# Altium project 安卓果园检测.PrjPcb
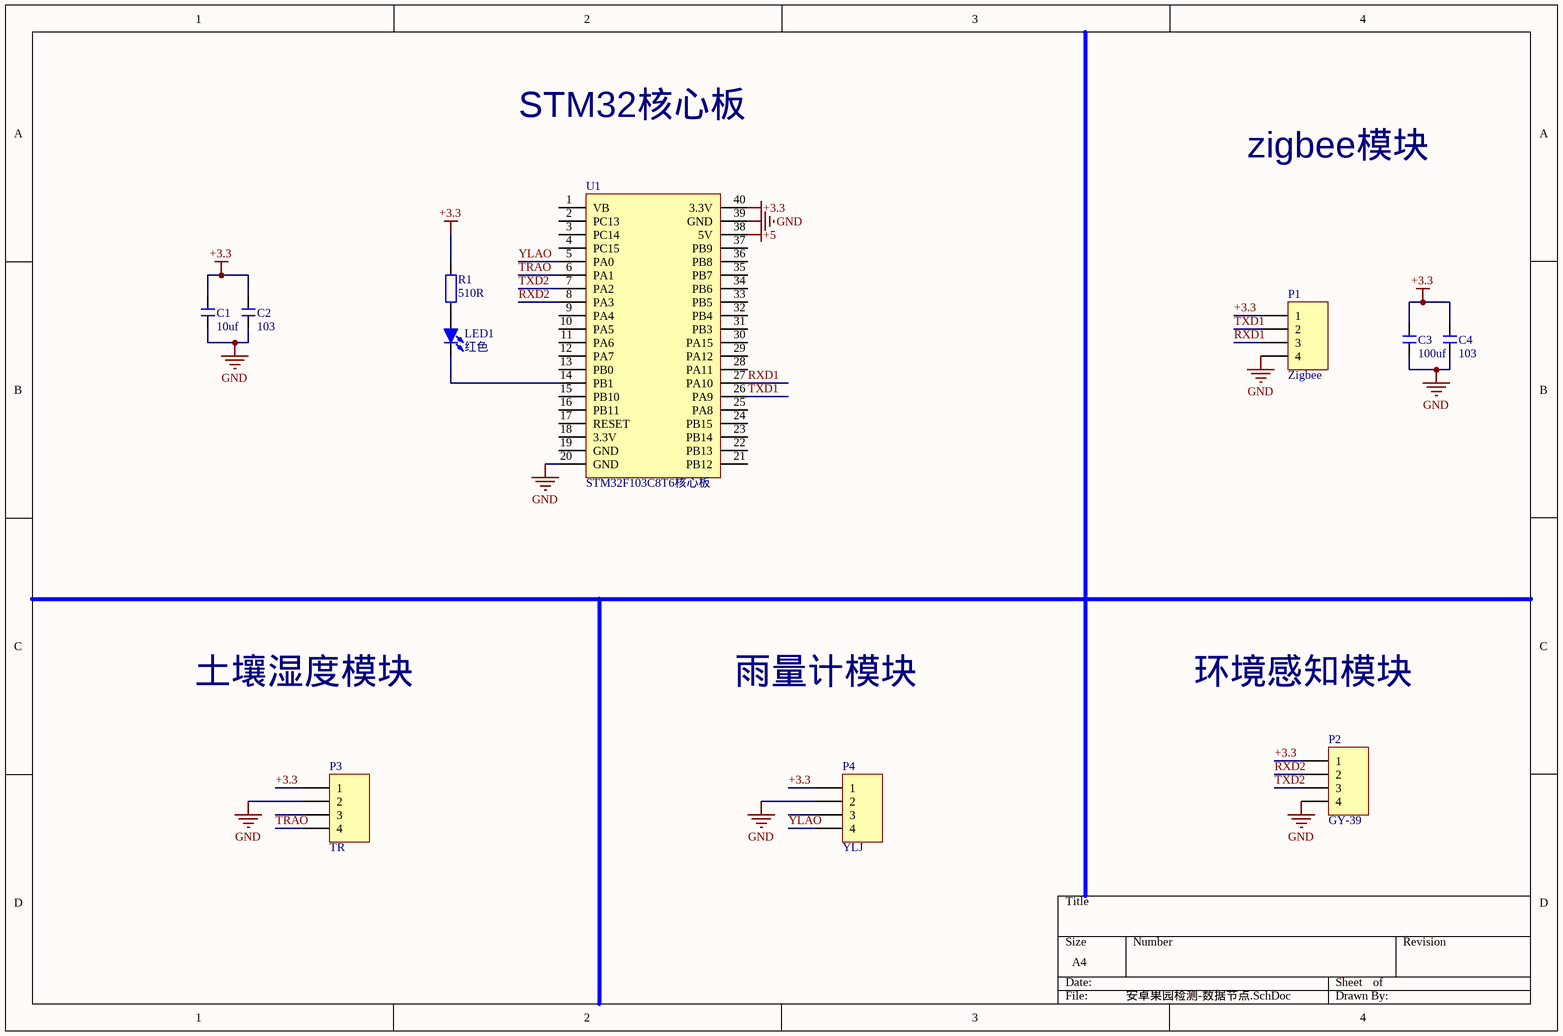
[diagram p0: 安卓果园检测-数据节点.SchDoc]
2 sheets, 31 parts. Net scope: global (net labels, ports and power ports of the same name join across sheets).
Sheets:
  安卓果园检测-数据节点.SchDoc
  安卓果园检测-转发节点.SchDoc

## Sheet 安卓果园检测-数据节点.SchDoc
size A4

### Parts
C1  10uf  [R 0805_M]
C2  103  [R 0805_M]
C3  100uf  [R 0805_M]
C4  103  [R 0805_M]
LED1  红色  [LED 0805R]
P1  Zigbee  [HDR1X4]
P2  GY-39  [HDR1X4]
P3  TR  [HDR1X4]
P4  YLJ  [HDR1X4]
R1  510R  [R 0805_M]
U1  STM32F103C8T6核心板  [DIP40-600_MH]

### Nets
+3.3: C1.1 C2.1 C3.1 C4.1 P1.1 P2.1 P3.1 P4.1 R1.2 U1.40(3.3V)
+5: U1.38(5V)
GND: C1.2 C2.2 C3.2 C4.2 P1.4 P2.4 P3.2 P4.2 U1.20(GND) U1.39(GND)
RXD1: P1.3 U1.27(PA10)
RXD2: P2.2 U1.8(PA3)
TRAO: P3.4 U1.6(PA1)
TXD1: P1.2 U1.26(PA9)
TXD2: P2.3 U1.7(PA2)
YLAO: P4.4 U1.5(PA0)
NetLED1_1: LED1.1(A) R1.1
NetLED1_2: LED1.2(K) U1.14(PB1)

Not connected (* = marked no-connect by the designer): P3 3; P4 3; U1 1(VB) 2(PC13) 3(PC14) 4(PC15) 9(PA4) 10(PA5) 11(PA6) 12(PA7) 13(PB0) 15(PB10) 16(PB11) 17(RESET) 18(3.3V) 19(GND) 21(PB12) 22(PB13) 23(PB14) 24(PB15) 25(PA8) 28(PA11) 29(PA12) 30(PA15) 31(PB3) 32(PB4) 33(PB5) 34(PB6) 35(PB7) 36(PB8) 37(PB9)

### Notes on the sheet
- STM32核心板
- zigbee模块
- 土壤湿度模块
- 雨量计模块
- 环境感知模块

### Library data of the parts
C1-C4 = C-CC: 直插瓷片电容; 版权归属: 源创客; BOM名称: 直插瓷片电容; 学习资源: www.ooocke.com
LED1 = LED-SMD: 贴片LED; 版权归属: 源创客; BOM名称: 贴片LED; 学习资源: www.ooocke.com
P1-P4 = Header 4: Header, 4-Pin; LatestRevisionDate: 17-Jul-2002; LatestRevisionNote: Re-released for DXP Platform.; Publisher: Altium Limited
R1 = R-CRR: 直插色环电阻; BOM名称: 色环电阻; 版权归属: 源创客; 学习资源: www.ooocke.com

## Sheet 安卓果园检测-转发节点.SchDoc
size A4
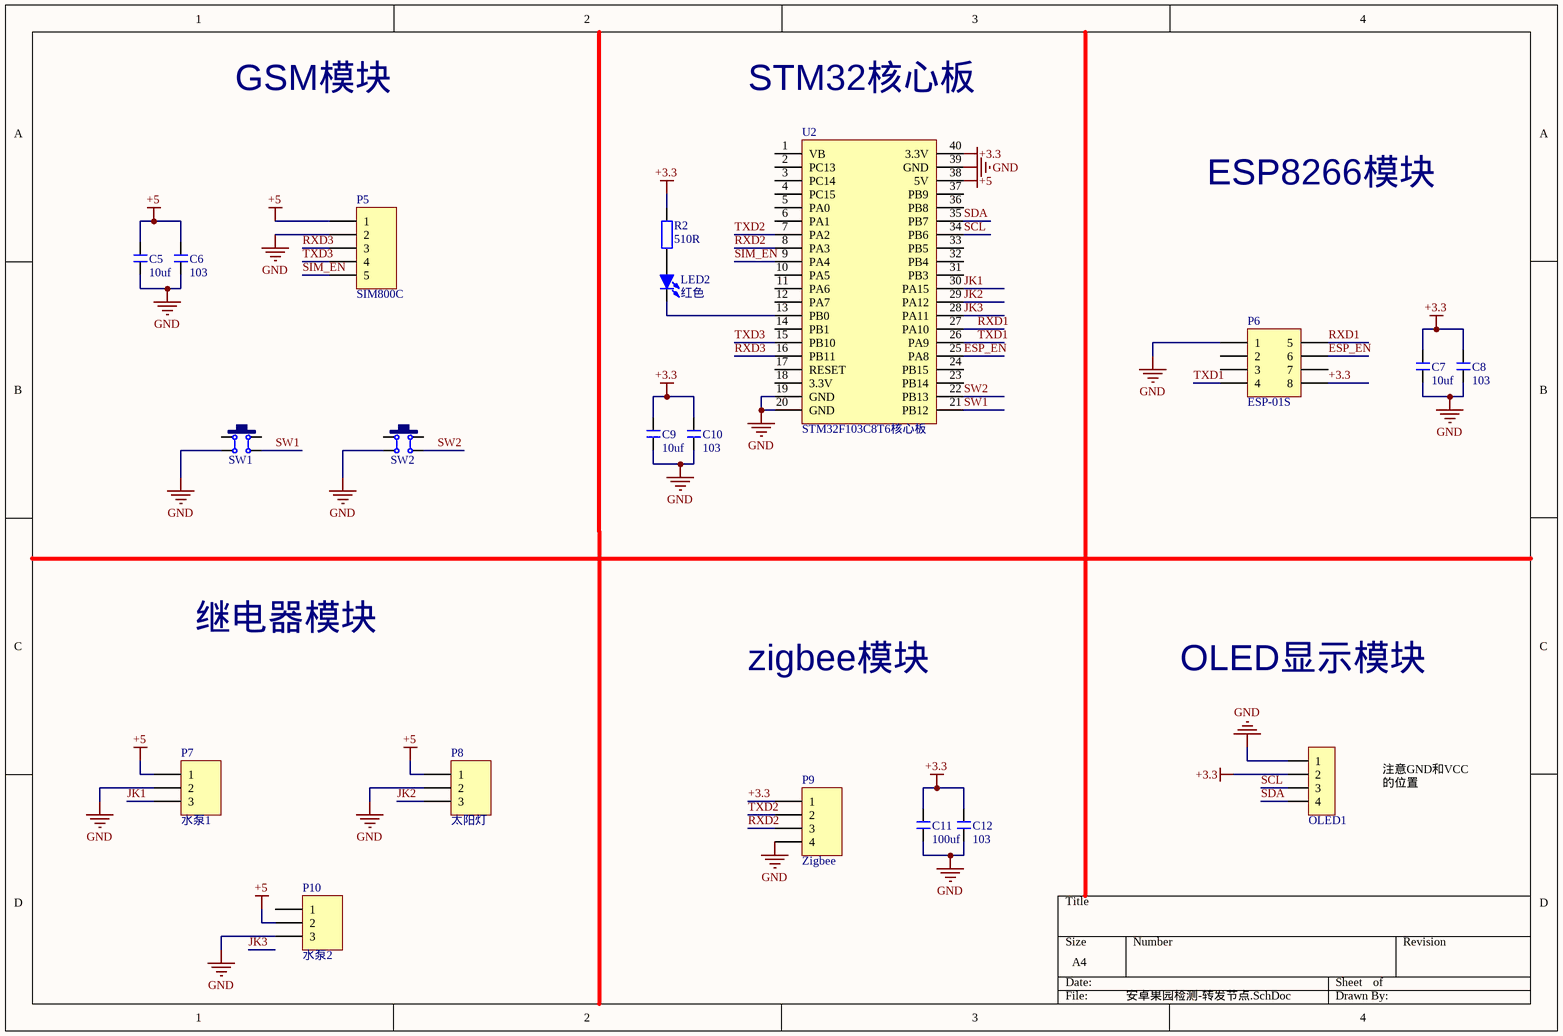
[diagram p1: 安卓果园检测-转发节点.SchDoc]

### Parts
C5  10uf  [R 0805_M]
C6  103  [R 0805_M]
C7  10uf  [R 0805_M]
C8  103  [R 0805_M]
C9  10uf  [R 0805_M]
C10  103  [R 0805_M]
C11  100uf  [R 0805_M]
C12  103  [R 0805_M]
LED2  红色  [LED 0805R]
OLED1  HDR-1X4  [HDR2.54-M-LI-4P]  (value not drawn)
P5  SIM800C  [HDR1X5]
P6  ESP-01S  [HDR2X4_CEN]
P7  水泵1  [MHDR1X3]
P8  太阳灯  [MHDR1X3]
P9  Zigbee  [HDR1X4]
P10  水泵2  [MHDR1X3]
R2  510R  [R 0805_M]
SW1  6x6x5  [TSW SMD-6*6*4.3]  (value not drawn)
SW2  6x6x5  [TSW SMD-6*6*4.3]  (value not drawn)
U2  STM32F103C8T6核心板  [DIP40-600_MH]

### Nets
+3.3: C7.1 C8.1 C9.1 C10.1 C11.1 C12.1 OLED1.2 P6.8 P9.1 R2.2 U2.40(3.3V)
+5: C5.1 C6.1 P5.1 P7.1 P8.1 P10.2 U2.38(5V)
GND: C5.2 C6.2 C7.2 C8.2 C9.2 C10.2 C11.2 C12.2 OLED1.1 P5.2 P6.1 P7.2 P8.2 P9.4 P10.3 SW1.4 SW2.4 U2.19(GND) U2.20(GND) U2.39(GND)
ESP_EN: P6.6 U2.25(PA8)
JK1: P7.3 U2.30(PA15)
JK2: P8.3 U2.29(PA12)
JK3: U2.28(PA11)
RXD1: P6.5 U2.27(PA10)
RXD2: P9.3 U2.8(PA3)
RXD3: P5.3 U2.16(PB11)
SCL: OLED1.3 U2.34(PB6)
SDA: OLED1.4 U2.35(PB7)
SIM_EN: P5.5 U2.9(PA4)
SW1: SW1.3 U2.21(PB12)
SW2: SW2.3 U2.22(PB13)
TXD1: P6.4 U2.26(PA9)
TXD2: P9.2 U2.7(PA2)
TXD3: P5.4 U2.15(PB10)
NetLED2_1: LED2.1(A) R2.1
NetLED2_2: LED2.2(K) U2.13(PB0)

Not connected (* = marked no-connect by the designer): P6 2 3 7; P10 1; SW1 1 2; SW2 1 2; U2 1(VB) 2(PC13) 3(PC14) 4(PC15) 5(PA0) 6(PA1) 10(PA5) 11(PA6) 12(PA7) 14(PB1) 17(RESET) 18(3.3V) 23(PB14) 24(PB15) 31(PB3) 32(PB4) 33(PB5) 36(PB8) 37(PB9)

### Notes on the sheet
- GSM模块
- STM32核心板
- ESP8266模块
- 继电器模块
- zigbee模块
- OLED显示模块
- 注意GND和VCC的位置

### Library data of the parts
C5-C12 = C-CC: 直插瓷片电容; 版权归属: 源创客; BOM名称: 直插瓷片电容; 学习资源: www.ooocke.com
LED2 = LED-SMD: 贴片LED; 版权归属: 源创客; BOM名称: 贴片LED; 学习资源: www.ooocke.com
OLED1 = Header 4: 4P接插件; 版权归属: 源创客; BOM名称: 4P接插件; 学习资源: www.ooocke.com
P5 = Header 5: Header, 5-Pin; LatestRevisionDate: 17-Jul-2002; LatestRevisionNote: Re-released for DXP Platform.; Publisher: Altium Limited
P6 = Header 4X2A: Header, 4-Pin, Dual row; LatestRevisionDate: 17-Jul-2002; LatestRevisionNote: Re-released for DXP Platform.; Publisher: Altium Limited
P7 P8 P10 = MHDR1X3: Header, 3-Pin; LatestRevisionDate: 17-Jul-2002; LatestRevisionNote: Re-released for DXP Platform.; Publisher: Altium Limited
P9 = Header 4: Header, 4-Pin; LatestRevisionDate: 17-Jul-2002; LatestRevisionNote: Re-released for DXP Platform.; Publisher: Altium Limited
R2 = R-CRR: 直插色环电阻; BOM名称: 色环电阻; 版权归属: 源创客; 学习资源: www.ooocke.com
SW1 SW2 = TSW SMD-6x6: 贴片6x6轻触开关; 版权归属: 源创客; BOM名称: 贴片6x6轻触开关; 学习资源: www.ooocke.com

## Nets that join several sheets
+3.3: 安卓果园检测-数据节点 (10 pins), 安卓果园检测-转发节点 (11 pins)
+5: 安卓果园检测-数据节点 (U1.38), 安卓果园检测-转发节点 (7 pins)
GND: 安卓果园检测-数据节点 (10 pins), 安卓果园检测-转发节点 (20 pins)
RXD1: 安卓果园检测-数据节点 (P1.3 U1.27), 安卓果园检测-转发节点 (P6.5 U2.27)
RXD2: 安卓果园检测-数据节点 (P2.2 U1.8), 安卓果园检测-转发节点 (P9.3 U2.8)
TXD1: 安卓果园检测-数据节点 (P1.2 U1.26), 安卓果园检测-转发节点 (P6.4 U2.26)
TXD2: 安卓果园检测-数据节点 (P2.3 U1.7), 安卓果园检测-转发节点 (P9.2 U2.7)